# EAGLE design stc15_dev (EAGLE 7.5.0)
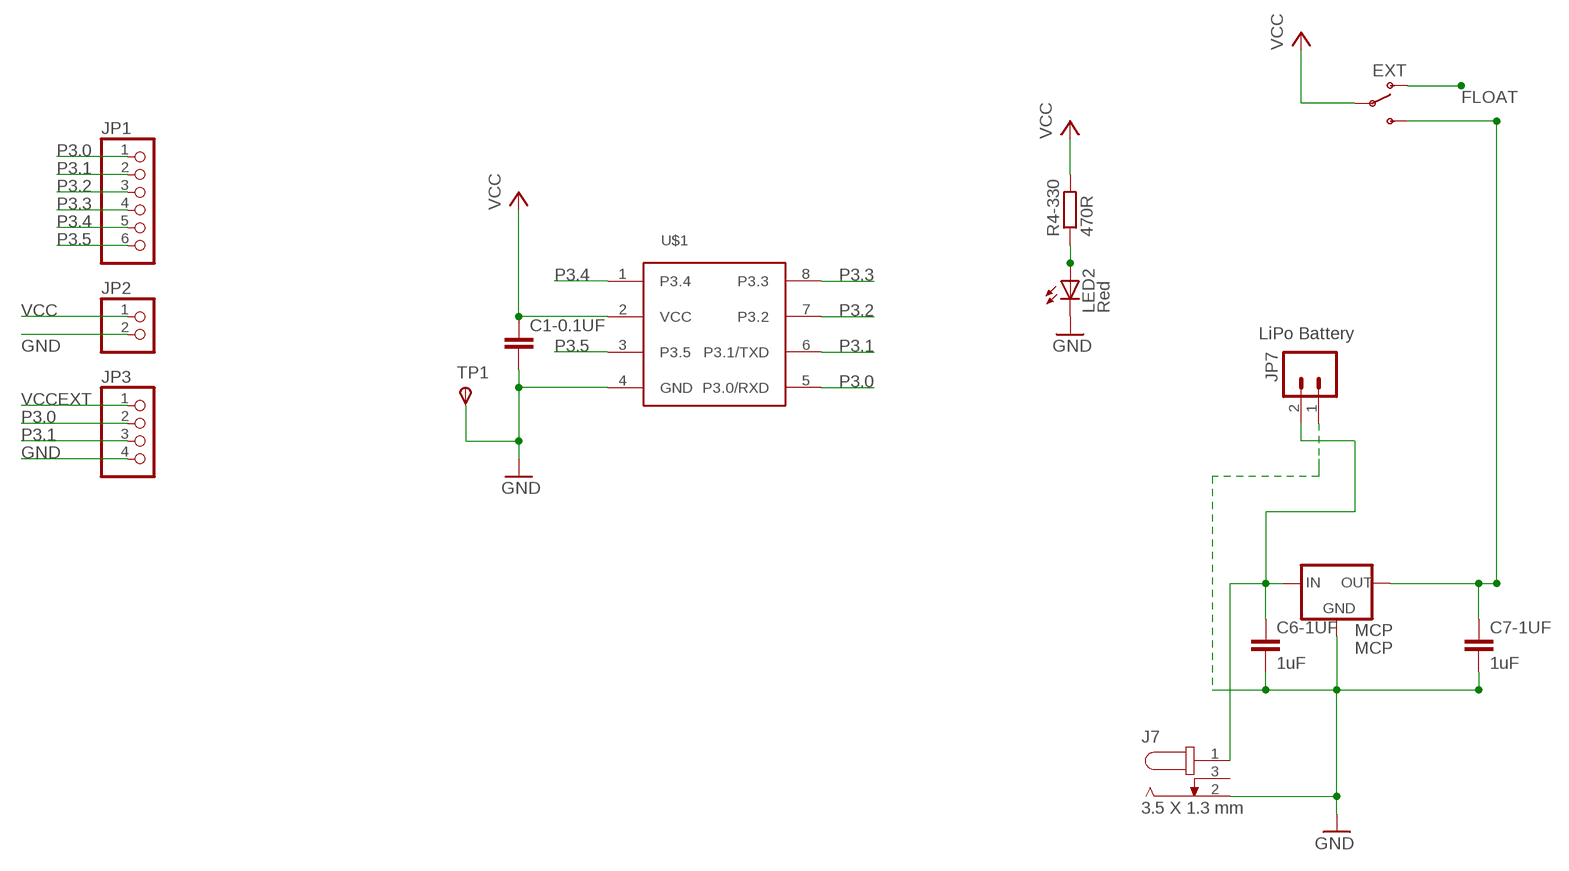
[diagram p0: schematic, sheet 1]

## Parts
C1-0.1UF  C-EU025-025X050  [C025-025X050]
C6-1UF  1uF  C-EU025-025X050  [C025-025X050]
C7-1UF  1uF  C-EU025-025X050  [C025-025X050]
J7  3.5 X 1.3 mm  DC_JACK_3.5X1.3MM  [3.5X1.3MM_DC_JACK]
JP1  PINHD-1X6  [1X06]
JP2  PINHD-1X2  [1X02]
JP3  PINHD-1X4  [1X04]
JP7  LiPo Battery  M02JST-PTH-2  [JST-2-PTH]
LED2  Red  LED3MM  [LED3MM]
MCP  MCP  MCP1700TO-92  [TO92-]
ON  EXT  SWITCH-SPSTPTH  [SWITCH-SPDT]
R4-330  470R  R-EU_0204/7  [0204/7]
TP1  TPSTP20R  [TP20R]
U$1  STC15F/L10XDIP  [DIL4]

## Nets
FLOAT: ON.1(O)
GND [GND]: C1-0.1UF.2 C6-1UF.2 C7-1UF.2 J7.2 JP2.2 JP3.4 JP7.1 LED2.K(C) MCP.3(GND) TP1.TP(PP) U$1.4(GND)
N$1: LED2.A R4-330.1
P3.0: JP1.1 JP3.2 U$1.5(P3.0/RXD)
P3.1: JP1.2 JP3.3 U$1.6(P3.1/TXD)
P3.2: JP1.3 U$1.7(P3.2)
P3.3: JP1.4 U$1.8(P3.3)
P3.4: JP1.5 U$1.1(P3.4)
P3.5: JP1.6 U$1.3(P3.5)
VCC [VCC]: C1-0.1UF.1 JP2.1 ON.2(P) R4-330.2 U$1.2(VCC)
VCCEXT [VCC]: C6-1UF.1 J7.1 JP3.1 JP7.2 MCP.2(IN)
VCCREG [VCC]: C7-1UF.1 MCP.1(OUT) ON.3(S)
Unconnected: J7.3

## Library data of the parts
C1-0.1UF C6-1UF C7-1UF = resistor:C-EU: CAPACITOR, European symbol
J7 = MY_CONN:DC_JACK_3.5X1.3MM
JP1 = pinhead:PINHD-1X6: PIN HEADER
JP2 = pinhead:PINHD-1X2: PIN HEADER
JP3 = pinhead:PINHD-1X4: PIN HEADER
JP7 = SparkFun:M02: Header 2 Standard 2-pin 0.1" header. Use with straight break away headers (SKU : PRT-00116), right angle break away headers (PRT-00553), swiss pins (PRT-00743), machine pins (PRT-00117), and female headers (PRT-00115). Molex polarized connector foot print use with SKU : PRT-08233 with associated crimp pins and housings.
LED2 = adafruit:LED: LED OSRAM: - CHIPLED LG R971, LG N971, LY N971, LG Q971, LY Q971, LO R971, LY R971 LH N974, LH R974 LS Q976, LO Q976, LY Q976 LO Q996 - Hyper CHIPLED LW Q18S LB Q993, LB Q99A, LB R99A - SideLED LS A670, LO A670, LY A670, LG A670, LP A670 LB A673, LV A673, LT A673, LW A673 LH A674 LY A675 LS A676, LA A676, LO A676, LY A676, LW A676 LS A679, LY A679, LG A679 - Hyper Micro SIDELED® LS Y876, LA Y876, LO Y876, LY Y876 LT Y87S - SmartLED LW L88C, LW L88S LB L89C, LB L89S, LG L890 LS L89K, LO L89K, LY L89K LS L896, LA L896, LO L896, LY L896 - TOPLED LS T670, LO T670, LY T670, LG T670, LP T670 LSG T670, LSP T670, LSY T670, LOP T670, LYG T670 LG T671, LOG T671, LSG T671 LB T673, LV T673, LT T673, LW T673 LH T674 LS T676, LA T676, LO T676, LY T676, LB T676, LH T676, LSB T676, LW T676 LB T67C, LV T67C, LT T67C, LS T67K, LO T67K, LY T67K, LW E67C LS E67B, LA E67B, LO E67B, LY E67B, LB E67C, LV E67C, LT E67C LW T67C LS T679, LY T679, LG T679 LS T770, LO T770, LY T770, LG T770, LP T770 LB T773, LV T773, LT T773, LW T773 LH T774 LS E675, LA E675, LY E675, LS T675 LS T776, LA T776, LO T776, LY T776, LB T776 LHGB T686 LT T68C, LB T68C - Hyper Mini TOPLED® LB M676 - Mini TOPLED Santana® LG M470 LS M47K, LO M47K, LY M47K Source: http://www.osram.convergy.de/
MCP = MY_IC:MCP1700
ON = SparkFun:SWITCH-SPST: SPST Switch Simple slide switch. Spark Fun Electronics SKU : COM-00102
R4-330 = resistor:R-EU_: RESISTOR, European symbol
TP1 = testpad:TPS: TEST PIN
U$1 = thierry_eagle:STC15F/L10X

## Net classes
0 default: width 0.508 mm
1 GND: width 0.889 mm, drill 0.508 mm, clearance 0.254 mm
2 VCC: width 0.889 mm, drill 0.508 mm, clearance 0.254 mm

## Board
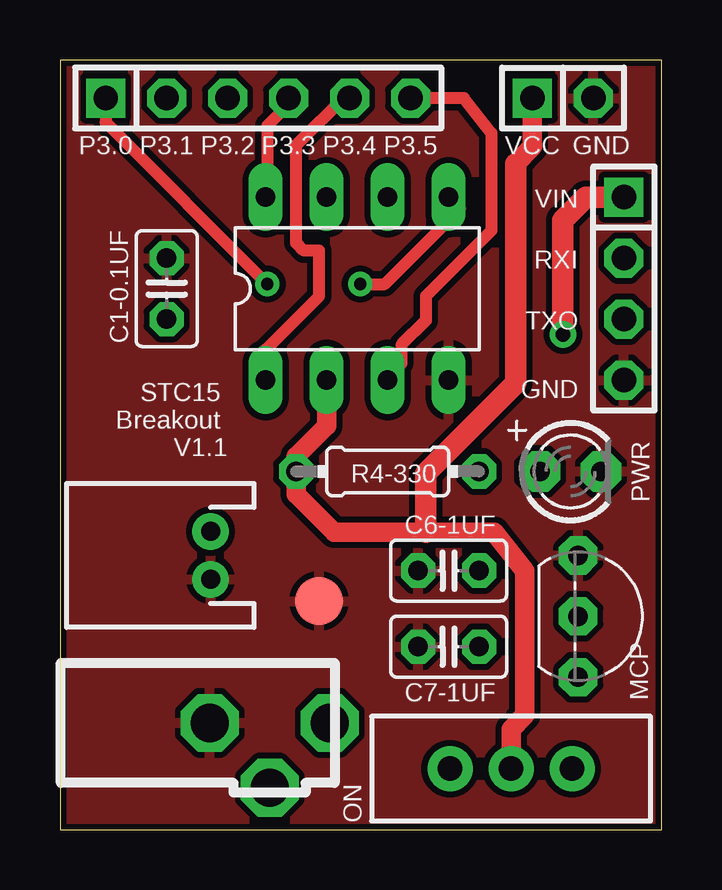
[diagram p1: board, top side]
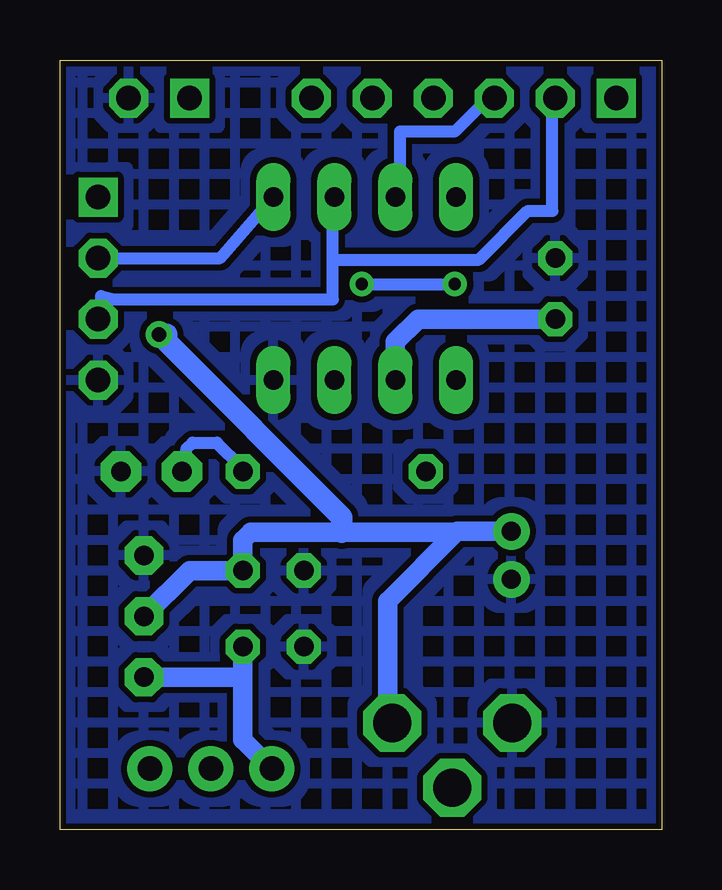
[diagram p2: board, bottom side, seen from below]

Size 25.08 x 32.07 mm. Coordinates in mm from the lower left corner, seen from the top.
Outline: 0,0 25.08,0 25.08,32.07 0,32.07 0,0
Copper layers (1*16): Top 0.035mm / dielectric 1.5mm / Bottom 0.035mm
Design rules "SparkFun *": minimum track width 20mil, minimum drill 20mil, track to track 8mil, track to pad 8mil, pad to pad 8mil, via to via 8mil, smd to smd 8mil, copper to edge 10mil, drill to drill 8mil, minimum pad ring 12mil, minimum via ring 10mil, stop-mask expansion 4mil, vias tented up to drill 25mil, thermal gap 10mil

### Footprints (pad centres in the part's own frame; a part is rotated, then mirrored left to right if it is on the bottom)
C025-025X050 = drill 0.813 octagon: 1 -1.27,0; 2 1.27,0
3.5X1.3MM_DC_JACK = drill 1.6 octagon: 1 0,0; 2 -5,0; 3 -2.5,-2.7
1X06 = drill 1.016 square: 1 -6.35,0 | drill 1.016 octagon: 2 -3.81,0; 3 -1.27,0; 4 1.27,0; 5 3.81,0; 6 6.35,0
1X02 = drill 1.016 square: 1 -1.27,0 | drill 1.016 octagon: 2 1.27,0
1X04 = drill 1.016 square: 1 -3.81,0 | drill 1.016 octagon: 2 -1.27,0; 3 1.27,0; 4 3.81,0
JST-2-PTH = drill 0.787 pad 1.524: 1 -1,0; 2 1,0
LED3MM = drill 0.813 pad 1.676 octagon: A -1.27,0; K 1.27,0
TO92- = drill 0.813 pad 1.6 octagon: 1 2.54,0; 2 0,0; 3 -2.54,0
SWITCH-SPDT = drill 1.016 pad 1.88: 1 0,2.54; 2 0,0; 3 0,-2.54
0204/7 = drill 0.813 octagon: 1 -3.81,0; 2 3.81,0
TP20R = smd 2 x 2: TP 0,0
DIL4 = drill 0.813 long: 1 -3.81,-3.81; 2 -1.27,-3.81; 3 1.27,-3.81; 4 3.81,-3.81; 5 3.81,3.81; 6 1.27,3.81; 7 -1.27,3.81; 8 -3.81,3.81

### Placement (x,y rotation side)
C1-0.1UF  4.45,22.54 90 top
C6-1UF  16.19,10.8 180 top
C7-1UF  16.19,7.62 180 top
J7  11.24,4.45 0 top
JP1  8.25,30.48 0 top
JP2  20.96,30.48 0 top
JP3  23.5,22.54 270 top
JP7  6.27,11.43 90 top
LED2  21.27,14.92 0 top
MCP  21.59,8.89 270 top
ON  18.8,2.54 270 top
R4-330  13.65,14.92 180 top
TP1  10.79,9.53 0 top
U$1  12.38,22.54 0 top

### Tracks (layer width: path | path; a pad name or v marks a point on that pad's centre or on a via)
GND
  pour Top: -0.64,32.7 25.72,32.7 25.72,-0.95 -0.64,-0.95
  pour Bottom (hatched): -0.64,32.7 25.72,32.7 25.72,-0.95 -0.64,-0.95
N$1
  Bottom 0.508: R4-330.1 17.53,15.11 18.54,16.13 19.56,16.13 19.81,15.88 LED2.A
P3.0  (via drill 0.51)
  Top 0.508: v8.64,22.73 1.9,29.46 JP1.1 | v12.51,22.73 13.53,22.73 16.67,25.88 U$1.5
  Bottom 0.508: U$1.5 18.42,23.81 JP3.2 | v12.51,22.73 v8.64,22.73
P3.1
  Bottom 0.508: 13.72,23.75 13.72,22.1 22.86,22.1 23.37,22.22 JP3.3 | 13.72,23.75 13.72,26.29 U$1.6 | 13.72,23.75 7.62,23.75 5.59,25.78 4.57,25.78 4.57,30.48 JP1.2
P3.2
  Bottom 0.508: U$1.7 10.92,26.54 10.92,29.08 8.64,29.08 7.11,30.61 JP1.3
P3.3
  Top 0.508: U$1.8 8.64,26.54 8.64,29.34 9.4,30.1 9.4,30.35 JP1.4
P3.4
  Top 0.508: JP1.5 11.94,30.61 9.84,28.51 9.84,24.45 10.16,24.13 10.79,24.13 10.79,22.22 8.57,20 U$1.1
P3.5
  Top 0.508: U$1.3 13.72,18.92 14.22,19.43 14.22,20.19 15.24,21.21 15.24,22.22 17.97,24.96 17.97,29.02 16.83,30.48 JP1.6
VCC
  Top 0.813: ON.2 18.8,4.19 19.37,4.76 19.37,10.8 18.1,12.38 15.24,12.38 11.43,12.38 9.84,13.97 R4-330.2 9.84,15.56 11.11,16.83 U$1.2 | JP2.1 19.69,28.45 18.99,27.75
  Top 0.889: 18.99,27.75 18.99,18.61 15.24,14.86 15.24,12.38
  Bottom 0.813: C1-0.1UF.1 10.16,21.27 11.11,20.32 U$1.2
VCCEXT  (via drill 0.6)
  Top 0.889: JP3.1 21.91,26.35 20.96,25.4 v20.96,20.64
  Bottom 0.813: JP7.2 8.53,12.43 8.57,12.38 | 8.57,12.38 11.43,9.53 11.43,5.27 J7.1 | 8.57,12.38 13.33,12.38 17.14,12.38 17.46,12.07 C6-1UF.1 19.69,10.8 MCP.2
  Bottom 0.889: 13.33,12.38 13.33,13.02 20.64,20.32 20.64,20.64 v20.96,20.64
VCCREG
  Bottom 0.813: MCP.1 17.46,6.35 | C7-1UF.1 17.46,6.35 | 17.46,6.35 17.46,3.75 ON.3

### Text on the board
tNames: P3.0 | P3.1 | P3.2 | P3.3 | P3.4 | P3.5 | VCC | GND | VIN | RXI | TXO | GND | STC15 / Breakout / V1.1 | PWR | MCP